# EAGLE design adapter27 (EAGLE 9.4.2)
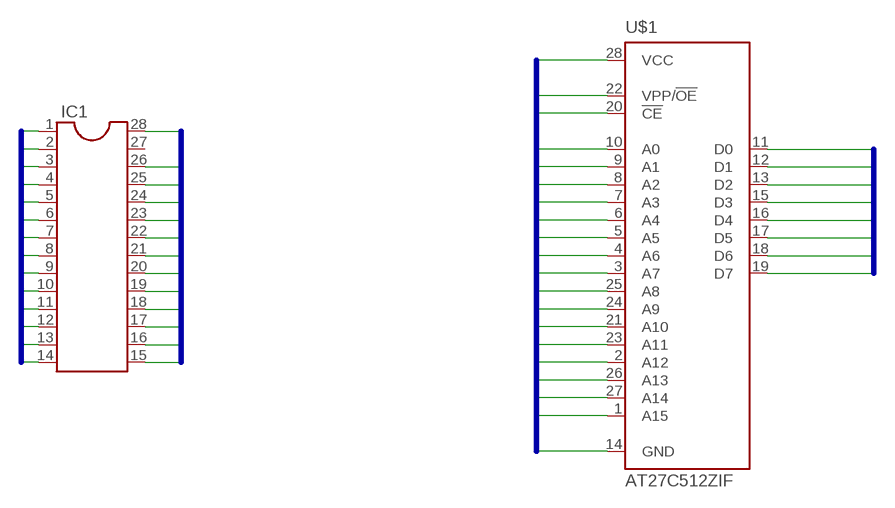
[diagram p0: schematic, sheet 1]

## Parts
IC1  DIL28  [DIL28-6]
U$1  AT27C512ZIF  [DIL28-3-ZIF_SOCKET]

## Nets
P1: IC1.1 U$1.1(A15)
P2: IC1.2 U$1.2(A12)
P3: IC1.3 U$1.3(A7)
P4: IC1.4 U$1.4(A6)
P5: IC1.5 U$1.5(A5)
P6: IC1.6 U$1.6(A4)
P7: IC1.7 U$1.7(A3)
P8: IC1.8 U$1.8(A2)
P9: IC1.9 U$1.9(A1)
P10: IC1.10 U$1.10(A0)
P11: IC1.11 U$1.11(D0)
P12: IC1.12 U$1.12(D1)
P13: IC1.13 U$1.13(D2)
P14: IC1.14 U$1.14(GND)
P15: IC1.15 U$1.15(D3)
P16: IC1.16 U$1.16(D4)
P17: IC1.17 U$1.17(D5)
P18: IC1.18 U$1.18(D6)
P19: IC1.19 U$1.19(D7)
P20: IC1.20 U$1.20(!CE)
P21: IC1.21 U$1.21(A10)
P22: IC1.22 U$1.22(VPP/!OE)
P23: IC1.23 U$1.23(A11)
P24: IC1.24 U$1.24(A9)
P25: IC1.25 U$1.25(A8)
P26: IC1.26 U$1.26(A13)
P27: U$1.27(A14)
P28: IC1.28 U$1.28(VCC)
Unconnected: IC1.27

## Buses
DIL28:P1,P2,P3,P4,P5,P6,P7,P8,P9,P10,P11,P12,P13,P14,P15,P16,P17,P18,P19,P20,P21,P22,P23,P24,P25,P26,P27,P28

## Library data of the parts
IC1 = ic-package:DIL28: Dual In Line
U$1 = wntrmute:AT27C512

## Net classes
0 default: width 0.152 mm, drill 0.254 mm, clearance 0.152 mm

## Board
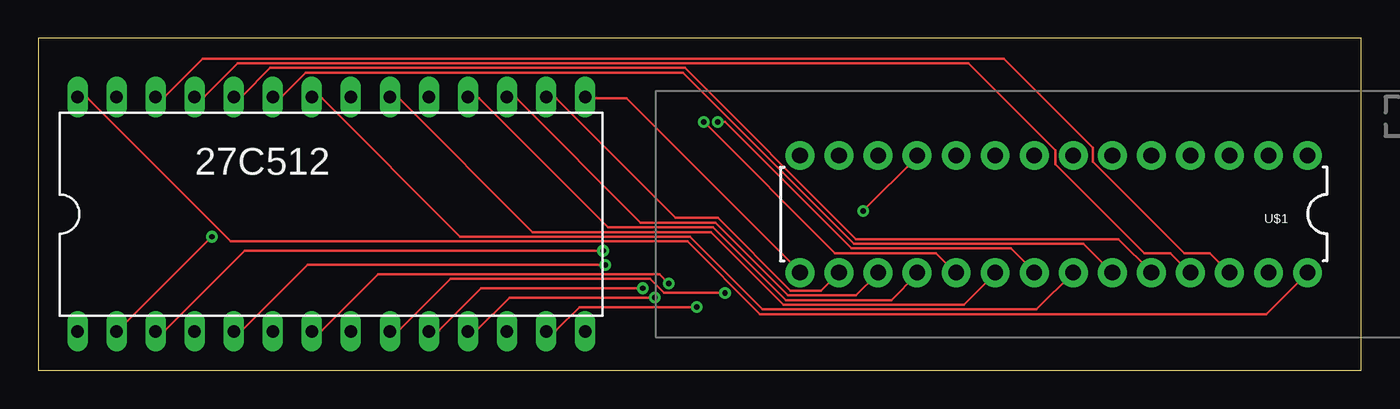
[diagram p1: board, top side]
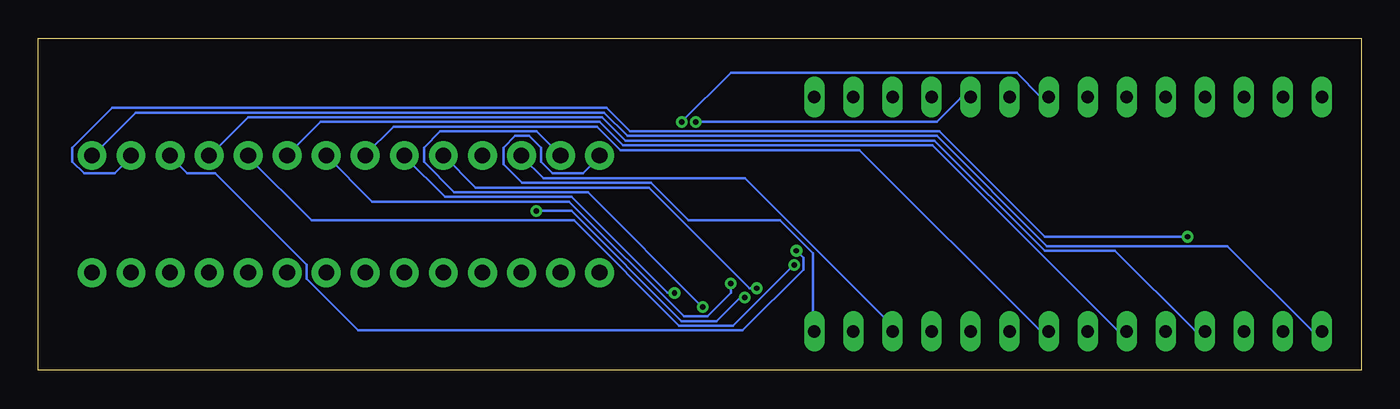
[diagram p2: board, bottom side, seen from below]

Size 86.03 x 21.58 mm. Coordinates in mm from the lower left corner, seen from the top.
Outline: 0,0 86.03,0 86.03,21.58 0,21.58 0,0
Copper layers (1*16): Top 0.035mm / dielectric 1.5mm / Bottom 0.035mm
Design rules "default": minimum track width 6mil, minimum drill 0.35mm, track to track 6mil, track to pad 6mil, pad to pad 6mil, via to via 6mil, smd to smd 6mil, copper to edge 40mil, drill to drill 6mil, minimum pad ring 10mil, minimum via ring 8mil, stop-mask expansion 4mil, vias tented up to drill 0mil, thermal gap 10mil

### Footprints (pad centres in the part's own frame; a part is rotated, then mirrored left to right if it is on the bottom)
DIL28-6 = drill 0.813 long: 1 -16.51,-7.62; 2 -13.97,-7.62; 3 -11.43,-7.62; 4 -8.89,-7.62; 5 -6.35,-7.62; 6 -3.81,-7.62; 7 -1.27,-7.62; 8 1.27,-7.62; 9 3.81,-7.62; 10 6.35,-7.62; 11 8.89,-7.62; 12 11.43,-7.62; 13 13.97,-7.62; 14 16.51,-7.62; 15 16.51,7.62; 16 13.97,7.62; 17 11.43,7.62; 18 8.89,7.62; 19 6.35,7.62; 20 3.81,7.62; 21 1.27,7.62; 22 -1.27,7.62; 23 -3.81,7.62; 24 -6.35,7.62; 25 -8.89,7.62; 26 -11.43,7.62; 27 -13.97,7.62; 28 -16.51,7.62
DIL28-3-ZIF_SOCKET = drill 1.016 pad 1.88: 1 -16.51,-3.81; 2 -13.97,-3.81; 3 -11.43,-3.81; 4 -8.89,-3.81; 5 -6.35,-3.81; 6 -3.81,-3.81; 7 -1.27,-3.81; 8 1.27,-3.81; 9 3.81,-3.81; 10 6.35,-3.81; 11 8.89,-3.81; 12 11.43,-3.81; 13 13.97,-3.81; 14 16.51,-3.81; 15 16.51,3.81; 16 13.97,3.81; 17 11.43,3.81; 18 8.89,3.81; 19 6.35,3.81; 20 3.81,3.81; 21 1.27,3.81; 22 -1.27,3.81; 23 -3.81,3.81; 24 -6.35,3.81; 25 -8.89,3.81; 26 -11.43,3.81; 27 -13.97,3.81; 28 -16.51,3.81

### Placement (x,y rotation side)
IC1  19.05,10.16 0 top
U$1  66.04,10.16 180 top

### Tracks (layer width: path | path; a pad name or v marks a point on that pad's centre or on a via)
P1
  Bottom 0.152: IC1.1 2.59,2.59 3.2,2.59 8.69,8.08 20.42,8.08 27.58,15.24 47.7,15.24 49.23,16.76 79.7,16.76 82.45,14.02 U$1.1
P2  (via drill 0.35)
  Top 0.152: v11.28,8.69 5.18,2.59 IC1.2
  Bottom 0.152: v11.28,8.69 20.57,8.69 27.43,15.54 47.55,15.54 49.07,17.07 81.23,17.07 83.82,14.48 83.82,13.56 83.06,12.8 81.08,12.8 80.01,13.87 U$1.2
P3  (via drill 0.35)
  Top 0.152: v36.73,7.77 13.41,7.77 8.23,2.59 7.62,2.59 IC1.3
  Bottom 0.152: v36.73,7.77 36.27,7.32 36.27,6.55 40.23,2.59 65.23,2.59 68.58,5.94 68.58,6.86 74.52,12.8 76.35,12.8 77.42,13.87 U$1.3
P4
  Bottom 0.152: IC1.4 10.21,2.59 10.82,2.59 16,7.77 20.57,7.77 27.74,14.94 47.85,14.94 49.38,16.46 72.39,16.46 74.83,14.02 U$1.4
P5  (via drill 0.35)
  Top 0.152: v36.88,6.86 17.53,6.86 13.26,2.59 12.8,2.59 IC1.5
  Bottom 0.152: v36.88,6.86 40.84,2.9 44.35,2.9 51.21,9.75 68.28,9.75 72.39,13.87 U$1.5
P6
  Bottom 0.152: U$1.6 67.67,16.15 49.53,16.15 48.01,14.63 27.89,14.63 15.85,2.59 15.24,2.59 IC1.6
P7  (via drill 0.35)
  Top 0.152: v41,5.64 40.39,6.25 22.1,6.25 18.44,2.59 17.83,2.59 IC1.7
  Bottom 0.152: v41,5.64 41,5.03 42.52,3.5 44.04,3.5 51.51,10.97 64.31,10.97 U$1.7
P8
  Bottom 0.152: IC1.8 20.42,2.59 20.88,2.59 32.61,14.33 48.16,14.33 49.68,15.85 62.94,15.85 64.77,14.02 U$1.8
P9  (via drill 0.35)
  Top 0.152: v44.65,5.03 40.69,5.03 39.78,5.94 26.82,5.94 23.47,2.59 22.86,2.59 IC1.9
  Bottom 0.152: v44.65,5.03 45.11,5.03 51.36,11.28 59.59,11.28 62.18,13.87 U$1.9
P10  (via drill 0.35)
  Top 0.152: v39.32,5.33 28.8,5.33 26.06,2.59 25.45,2.59 IC1.10
  Bottom 0.152: v39.32,5.33 39.78,5.33 46.33,11.89 57.61,11.89 U$1.10
P11  (via drill 0.35)
  Top 0.152: v40.08,4.72 30.63,4.72 28.5,2.59 28.04,2.59 IC1.11 | v53.65,10.36 57.15,13.87 U$1.11
  Bottom 0.152: v40.08,4.72 40.39,4.72 41.91,3.2 44.2,3.2 51.36,10.36 v53.65,10.36
P12
  Bottom 0.152: IC1.12 30.48,2.9 40.08,12.5 53.19,12.5 54.56,13.87 U$1.12
P13  (via drill 0.35)
  Top 0.152: v42.82,4.12 35.2,4.12 33.68,2.59 33.07,2.59 IC1.13
  Bottom 0.152: v42.82,4.12 50.29,11.58 58.98,11.58 60.96,13.56 60.96,14.48 59.89,15.54 53.65,15.54 U$1.13
P14
  Bottom 0.152: IC1.14 35.66,2.59 35.66,7.62 37.8,9.75 43.74,9.75 46.18,12.19 54.56,12.19 55.78,13.41 55.78,14.48 55.02,15.24 54.1,15.24 53.34,14.48 53.34,13.56 52.58,12.8 50.6,12.8 49.53,13.87 U$1.14
P15
  Top 0.152: IC1.15 35.66,17.68 38.25,17.68 49.53,6.4 U$1.15
P16
  Top 0.152: U$1.16 50.9,5.18 48.92,5.18 44.2,9.91 41.45,9.91 33.68,17.68 33.07,17.68 IC1.16
P17
  Top 0.152: IC1.17 30.48,17.68 31.09,17.68 39.17,9.6 44.04,9.6 48.77,4.88 53.19,4.88 54.56,6.25 U$1.17
P18
  Top 0.152: IC1.18 28.04,17.68 28.65,17.68 37.03,9.3 43.89,9.3 48.62,4.57 55.47,4.57 57.15,6.25 U$1.18
P19  (via drill 0.35)
  Top 0.152: v43.28,16.15 51.82,7.62 58.37,7.62 59.59,6.4 U$1.19
  Bottom 0.152: v43.28,16.15 27.58,16.15 26.06,17.68 25.45,17.68 IC1.19
P20
  Top 0.152: IC1.20 22.86,17.68 23.47,17.68 32.16,8.99 43.74,8.99 48.46,4.27 60.2,4.27 62.18,6.25 U$1.20
P21  (via drill 0.35)
  Top 0.152: v44.2,16.15 44.65,16.15 52.88,7.92 63.25,7.92 64.77,6.4 U$1.21
  Bottom 0.152: v44.2,16.15 41,19.36 22.4,19.36 20.88,17.83 20.42,17.83 IC1.21
P22
  Top 0.152: U$1.22 64.92,3.96 47.09,3.96 42.37,8.69 27.43,8.69 18.44,17.68 17.83,17.68 IC1.22
P23
  Top 0.152: U$1.23 67.97,8.23 53.03,8.23 41.91,19.36 17.37,19.36 15.85,17.83 15.24,17.83 IC1.23
P24
  Top 0.152: IC1.24 12.8,17.83 13.26,17.83 15.09,19.66 42.06,19.66 53.19,8.53 70.26,8.53 72.39,6.4 U$1.24
P25
  Top 0.152: IC1.25 10.21,17.83 10.82,17.83 12.95,19.96 60.5,19.96 66.14,14.33 66.14,13.41 71.93,7.62 73.61,7.62 74.83,6.4 U$1.25
P26
  Top 0.152: U$1.26 76.2,7.62 74.52,7.62 68.58,13.56 68.58,14.48 62.79,20.27 10.67,20.27 8.23,17.83 7.62,17.83 IC1.26
P28
  Top 0.152: U$1.28 79.86,3.66 46.94,3.66 42.22,8.38 12.5,8.38 3.2,17.68 2.59,17.68 IC1.28

### Text on the board
tPlace: 27C512